# Altium schematic sheet МИЭМ.467999.001Э3(3).SchDoc
size 420 x 297 mm; SheetNumber: 3; SheetTotal: 4; DecimalNumber: МИЭМ.467999.001Э3
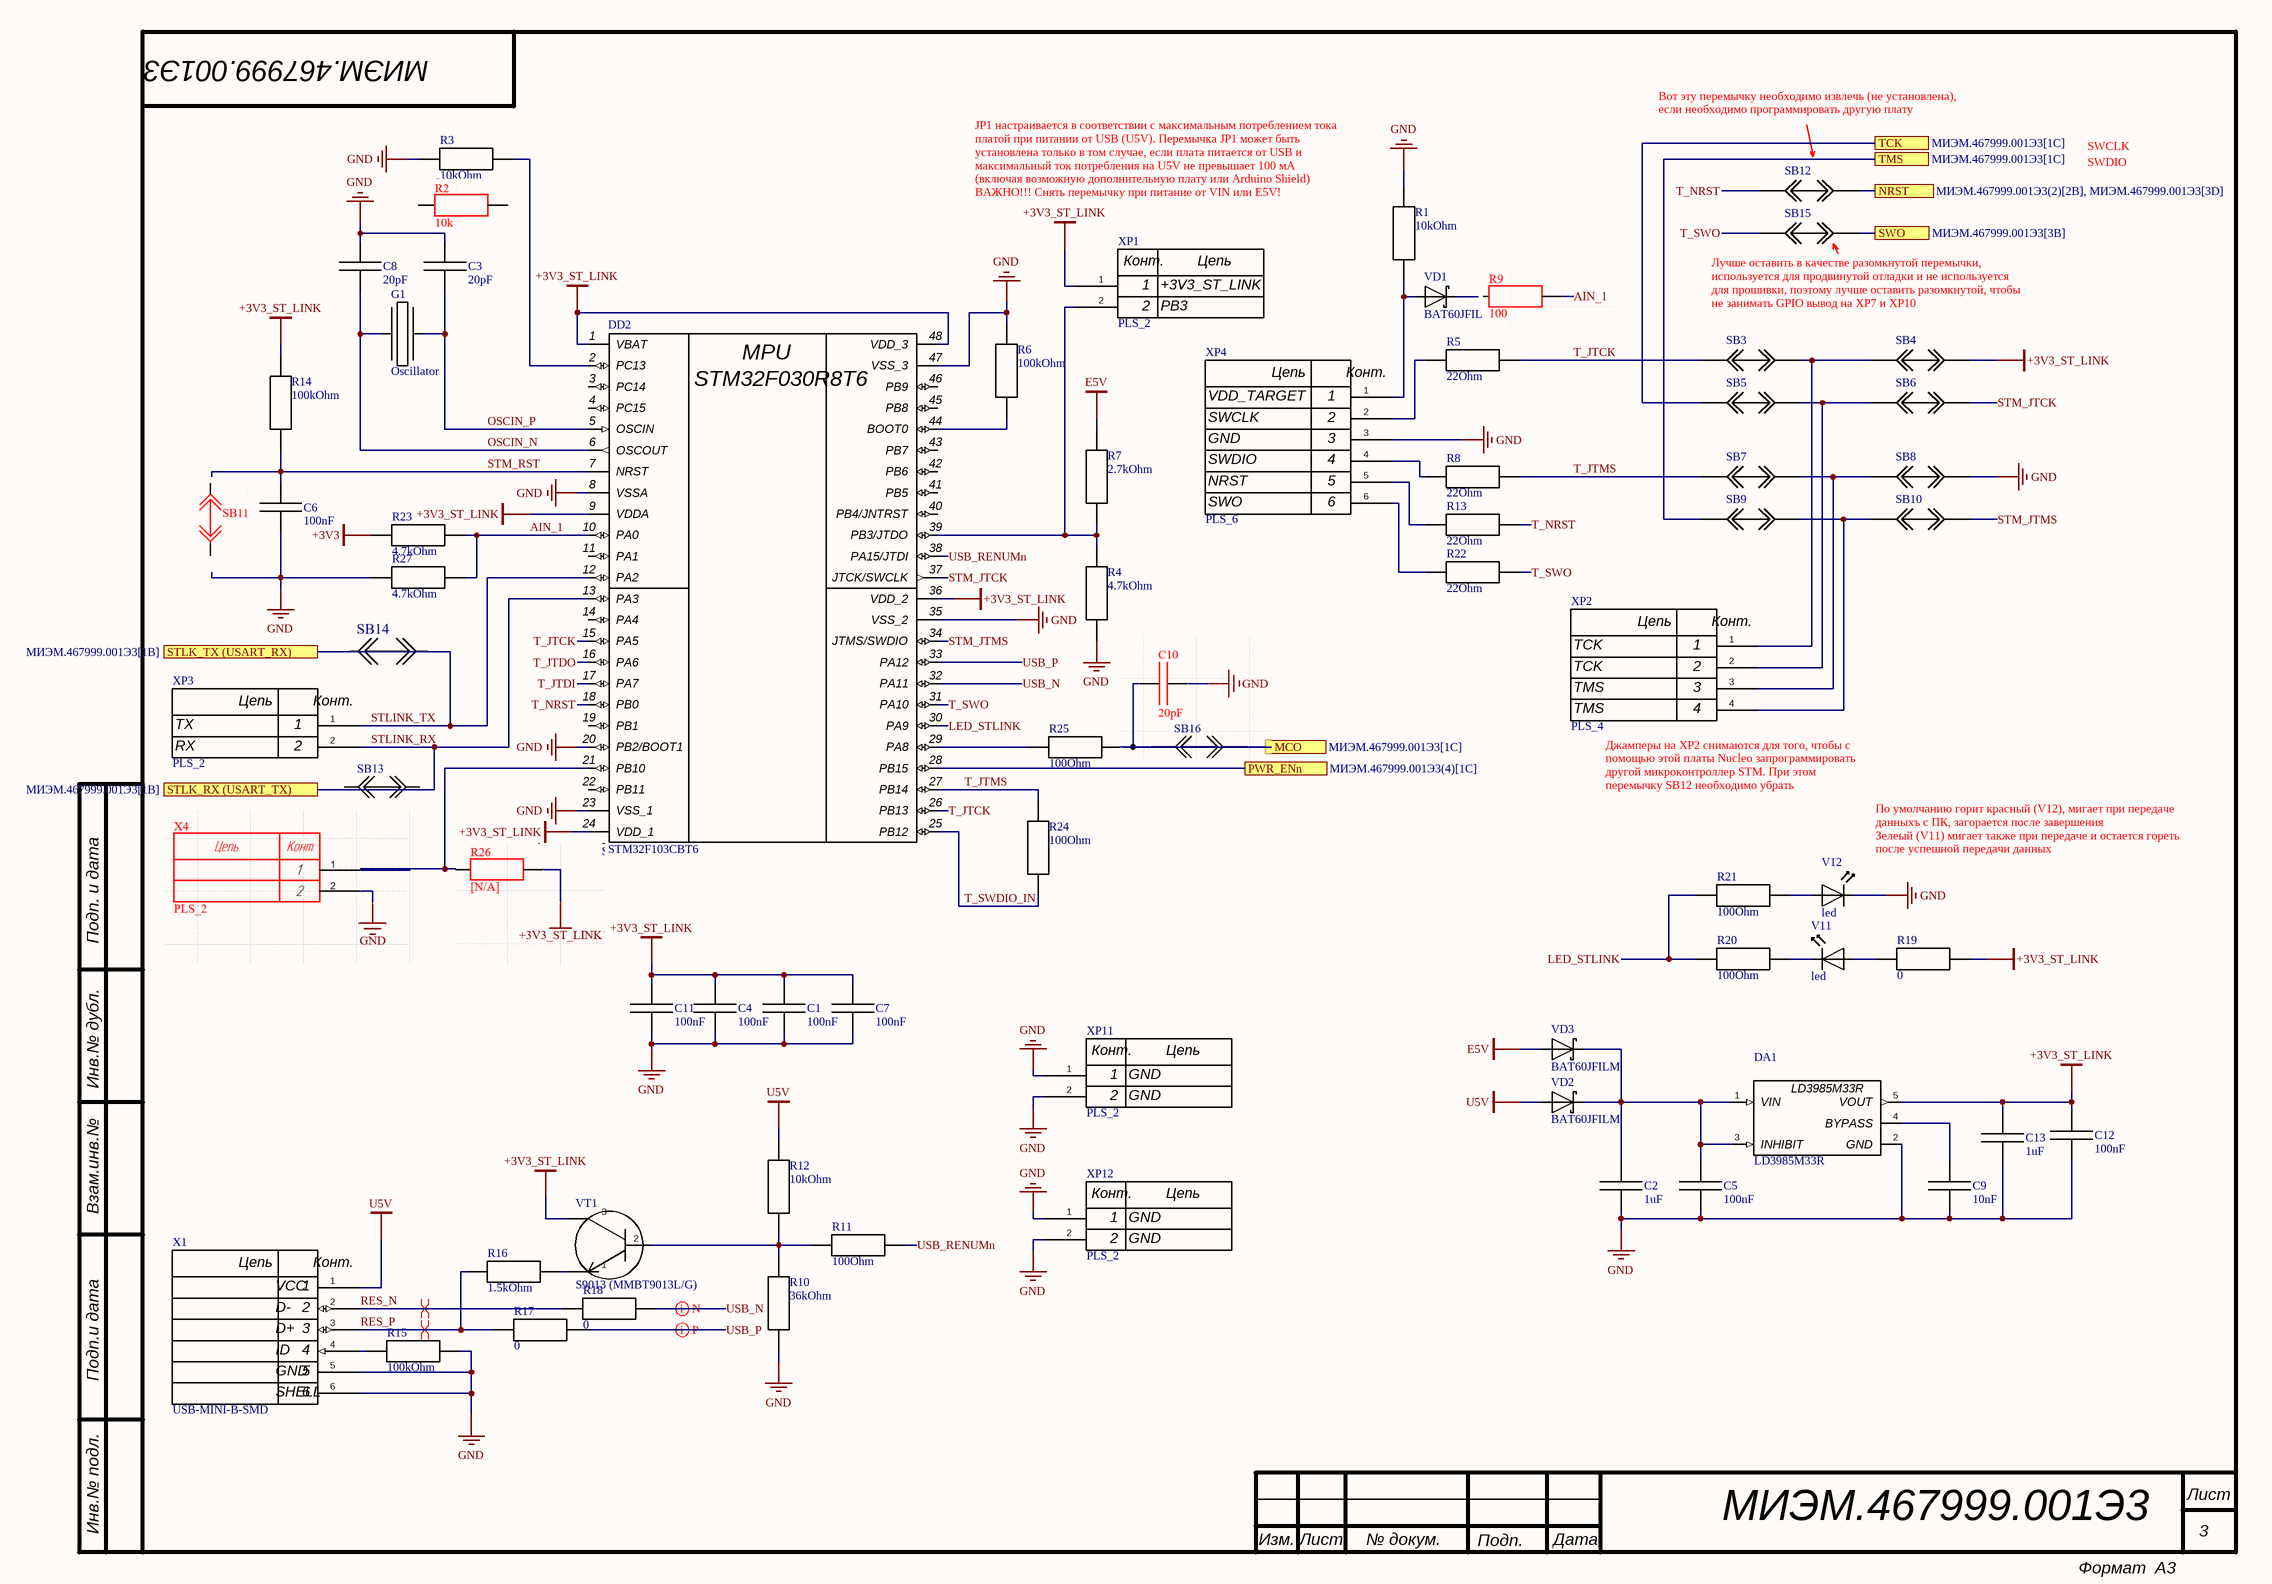
[diagram p0: МИЭМ.467999.001Э3(3).SchDoc]

## Parts
C1  100nF  [0603]
C2  1uF  [0603]
C3  20pF  [0603]
C4  100nF  [0603]
C5  100nF  [0603]
C6  100nF  [0603]
C7  100nF  [0603]
C8  20pF  [0603]
C9  10nF  [0603]
C11  100nF  [0603]
C12  100nF  [0603]
C13  1uF  [0603]
DA1  LD3985M33R  [LD3985M33R (SOT-23-5)]
DD2  STM32F103CBT6  [LQFP48-7x7mm]
G1  Oscillator  [HC49SMD]
R1  10kOhm  [0603]
R3  10kOhm  [0603]
R4  4.7kOhm  [0603]
R5  22Ohm  [0603]
R6  100kOhm  [0603]
R7  2.7kOhm  [0603]
R8  22Ohm  [0603]
R10  36kOhm  [0603]
R11  100Ohm  [0603]
R12  10kOhm  [0603]
R13  22Ohm  [0603]
R14  100kOhm  [0603]
R15  100kOhm  [0603]
R16  1.5kOhm  [0603]
R17  0  [0603]
R18  0  [0603]
R19  0  [0603]
R20  100Ohm  [0603]
R21  100Ohm  [0603]
R22  22Ohm  [0603]
R23  4.7kOhm  [0603]
R24  100Ohm  [0603]
R25  100Ohm  [0603]
R27  4.7kOhm  [0603]
SB3  Jumper  [Jumper]  (value not drawn)
SB4  Jumper  [Jumper]  (value not drawn)
SB5  Jumper  [Jumper]  (value not drawn)
SB6  Jumper  [Jumper]  (value not drawn)
SB7  Jumper  [Jumper]  (value not drawn)
SB8  Jumper  [Jumper]  (value not drawn)
SB9  Jumper  [Jumper]  (value not drawn)
SB10  Jumper  [Jumper]  (value not drawn)
SB12  Jumper  [Jumper]  (value not drawn)
SB15  Jumper  [Jumper]  (value not drawn)
V11  led  [FYLS-0603PGC]
V12  led  [FYLS-0603PGC]
VD1  BAT60JFILM  [BAT60JFILM]
VD2  BAT60JFILM  [BAT60JFILM]
VD3  BAT60JFILM  [BAT60JFILM]
VT1  S9013 (MMBT9013L/G)  [S9013 (SOT_23_3)]
X1  USB-MINI-B-SMD  [USB-MINI-B-SMD]
XP1  PLS_2  [PLS_2]
XP2  PLS_4  [PLS_4]
XP3  PLS_2  [PLS_2]
XP4  PLS_6  [PLS_6]
XP11  PLS_2  [PLS_2]
XP12  PLS_2  [PLS_2]

## Ports
MCO (see МИЭМ.467999.001Э3[1C]), NRST (see МИЭМ.467999.001Э3(2)[2B], МИЭМ.467999.001Э3[3D]), PWR_ENn (see МИЭМ.467999.001Э3(4)[1C]), STLK_RX (USART_TX) (see МИЭМ.467999.001Э3[1B]), STLK_TX (USART_RX) (see МИЭМ.467999.001Э3[1B]), SWO (see МИЭМ.467999.001Э3[3B]), TCK (see МИЭМ.467999.001Э3[1C]), TMS (see МИЭМ.467999.001Э3[1C])

## Nets
+3V3: R23.1
+3V3_ST_LINK: C1.2 C4.2 C7.2 C11.2 C12.2 C13.2 DA1.5(VOUT) DD2.1(VBAT) DD2.9(VDDA) DD2.24(VDD_1) DD2.36(VDD_2) DD2.48(VDD_3) R14.2 R19.2 SB4.2 VT1.3 XP1.1
E5V: R7.2 VD3.2
GND: C1.1 C2.1 C3.2 C4.1 C5.1 C6.1 C7.1 C8.2 C9.1 C11.1 C12.1 C13.1 DA1.2(GND) DD2.8(VSSA) DD2.20(PB2/BOOT1) DD2.23(VSS_1) DD2.35(VSS_2) DD2.47(VSS_3) R1.1 R3.1 R4.1 R6.2 R10.1 R15.2 R27.1 SB8.2 V12.2 X1.5 X1.6 XP4.3 XP11.1 XP11.2 XP12.1 XP12.2
U5V: R12.2 VD2.2 X1.1
AIN_1: DD2.10(PA0) R23.2 R27.2
LED_STLINK: DD2.30(PA9) R20.1 R21.1
MCO: R25.1 ; port MCO
NRST: SB12.2 ; port NRST
OSCIN_N: C8.1 DD2.6(OSCOUT) G1.1
OSCIN_P: C3.1 DD2.5(OSCIN) G1.2
PWR_ENn: DD2.28(PB15) ; port PWR_ENn
RES_N: R18.1 X1.2
RES_P: R16.1 R17.1 X1.3
STLINK_RX: DD2.13(PA3) XP3.2 ; port STLK_RX (USART_TX)
STLINK_TX: DD2.12(PA2) XP3.1 ; port STLK_TX (USART_RX)
STM_JTCK: DD2.37(JTCK/SWCLK) SB6.2
STM_JTMS: DD2.34(JTMS/SWDIO) SB10.2
STM_RST: C6.2 DD2.7(NRST) R14.1
SWO: SB15.2 ; port SWO
T_JTCK: DD2.15(PA5) DD2.26(PB13) R5.1 SB3.1
T_JTDI: DD2.17(PA7)
T_JTDO: DD2.16(PA6)
T_JTMS: DD2.27(PB14) R8.1 R24.2 SB7.1
T_NRST: DD2.18(PB0) R13.1 SB12.1
T_SWDIO_IN: DD2.25(PB12) R24.1
T_SWO: DD2.31(PA10) R22.1 SB15.1
TCK: SB5.1 ; port TCK
TMS: SB9.1 ; port TMS
USB_N: DD2.32(PA11) R18.2
USB_P: DD2.33(PA12) R17.2
USB_RENUMn: DD2.38(PA15/JTDI) R11.1
NetC2_2: C2.2 C5.2 DA1.1(VIN) DA1.3(INHIBIT) VD2.1 VD3.1
NetC9_2: C9.2 DA1.4(BYPASS)
NetDD2_2: DD2.2(PC13) R3.2
NetDD2_29: DD2.29(PA8) R25.2
NetDD2_39: DD2.39(PB3/JTDO) R4.2 R7.1 XP1.2
NetDD2_44: DD2.44(BOOT0) R6.1
NetR1_2: R1.2 VD1.2 XP4.1
NetR5_2: R5.2 XP4.2
NetR8_2: R8.2 XP4.4
NetR10_2: R10.2 R11.2 R12.1 VT1.2
NetR13_2: R13.2 XP4.5
NetR15_1: R15.1 X1.4
NetR16_2: R16.2 VT1.1
NetR19_1: R19.1 V11.1
NetR20_2: R20.2 V11.2
NetR21_2: R21.2 V12.1
NetR22_2: R22.2 XP4.6
NetSB3_2: SB3.2 SB4.1 XP2.1
NetSB5_2: SB5.2 SB6.1 XP2.2
NetSB7_2: SB7.2 SB8.1 XP2.3
NetSB9_2: SB9.2 SB10.1 XP2.4

Not connected (* = marked no-connect by the designer): DD2 3(PC14) 4(PC15) 11(PA1) 14(PA4) 19(PB1) 21(PB10) 22(PB11) 40(PB4/JNTRST) 41(PB5) 42(PB6) 43(PB7) 45(PB8) 46(PB9); VD1 1

## Layout directives
differential pair: RES_N, RES_P, USB_N, USB_P

## Notes on the sheet
- Вот эту перемычку необходимо извлечь (не установлена), если необходимо программировать другую плату
- SWCLK
- SWDIO
- JP1 настраивается в соответствии с максимальным потреблением тока платой при питании от USB (U5V). Перемычка JP1 может быть установлена только в том случае, если плата питается от USB и максимальный ток потребления на U5V не превышает 100 мА (включая возможную дополнительную плату или Arduino Shield)
  ВАЖНО!!! Снять перемычку при питание от VIN или E5V!
- (near XP1) 1
- (near XP1) 2
- (near XP1) +3V3_ST_LINK
- (near XP1) PB3
- (near SB15) Лучше оставить в качестве разомкнутой перемычки, используется для продвинутой отладки и не используется для прошивки, поэтому лучше оставить разомкнутой, чтобы не занимать GPIO вывод на XP7 и XP10
- VDD_TARGET
- GND
- (near XP4) 1
- (near XP4) 2
- (near XP4) 3
- NRST
- SWO
- (near XP4) 4
- (near XP4) 5
- (near XP4) 6
- TCK
- (near XP2) 1
- TX
- (near XP3) 1
- TMS
- (near XP2) 2
- (near XP2) 3
- (near XP2) 4
- RX
- (near XP3) 2
- (near XP2) Джамперы на XP2 снимаются для того, чтобы с помощью этой платы Nucleo запрограммировать другой микроконтроллер STM. При этом перемычку SB12 необходимо убрать
- (near V12) По умолчанию горит красный (V12), мигает при передаче данныхъ с ПК, загорается после завершения
  Зелеый (V11) мигает также при передаче и остается гореть после успешной передачи данных
- (near XP11) 1
- (near XP11) 2
- (near XP11) GND
- (near XP12) 1
- (near XP12) 2
- (near XP12) GND
- Подп. и дата
- Инв.№ дубл.
- Взам.инв.№
- Подп.и дата
- Инв.№ подл.
- Изм.
- Лист
- № докум.
- Подп.
- Дата
- Формат  A3
- (in symbol PLS_2) Цепь; Конт.
- (in symbol PLS_4) Цепь; Конт.
- (in symbol PLS_6) Цепь; Конт.
- (in symbol STM32F103CBT6) MPU; STM32F030R8T6
- (in symbol USB-MINI-B-SMD) Цепь; Конт.; VCC; D-; D+; ID; GND; SHELL

## Library data of the parts
C1 C4-C7 C11 C12 = Сapacitor: PartNumber: CC0603KRX7R0BB104; Manufacturer: Yageo; VCC: 100В; Tolerance: 10%; Ta: 125°C; Value: 100nF; Package: 0603; ComponentLink1Description: Datasheet; ComponentLink1URL: *; ComponentLink2Description: Source
  C1 C5 C6 C11 C12: ComponentLink2URL: https://www.chipdip.ru/product/0.1mkf-x7r-100v-10-0603-cc0603krx7r0bb104-kondensator-yageo-9000578715
  C4 C7: ComponentLink2URL: *
C2 C13 = Сapacitor: PartNumber: GRM185R61A105K; Manufacturer: Murata Electronics; VCC: 10В; Tolerance: 10%; Ta: 85°C; Value: 1uF; Package: 0603; ComponentLink1Description: Datasheet; ComponentLink1URL: *; ComponentLink2Description: Source; ComponentLink2URL: https://www.chipdip.ru/product/1mkf-x5r-10v-10-0603-grm185r61a105k-kondensator-murata-767906735
C3 C8 = Сapacitor: PartNumber: GRM1885C1H200J; Manufacturer: Murata Electronics; VCC: 50В; Tolerance: 5%; Ta: 125°C; Value: 20pF; Package: 0603; ComponentLink1Description: Datasheet; ComponentLink1URL: *; ComponentLink2Description: Source; ComponentLink2URL: https://www.chipdip.ru/product/20pf-np0-50v-5-0603-grm1885c1h200j-kondensator-murata-268501846
C9 = Сapacitor: PartNumber: CC0603KRX7R0BB103; Manufacturer: Yageo; VCC: 100В; Tolerance: 10%; Ta: 125°C; Value: 10nF; Package: 0603; ComponentLink1Description: Datasheet; ComponentLink1URL: *; ComponentLink2Description: Source; ComponentLink2URL: https://www.chipdip.ru/product/0.01mkf-x7r-100v-10-0603-cc0603krx7r0bb103-yageo-9000501772
DA1 = LD3985M33R: Manufacturer: STMicroelectronics; Desc: Стабилизатор напряжения линейный; VCC: 6 В; Vout: 3.3 В; Ta: 125 °C; ComponentLink1Description: Source; ComponentLink1URL: https://www.chipdip.ru/product/ld3985m33r-regulyator-s-nizkim-padeniem-st-microelectronics-9060001543; ComponentLink2Description: Datasheet; ComponentLink2URL: *; Package: SOT-23-5
DD2 = STM32F103CBT6: Manufacturer: STMicroelectronics; Desc: Микроконтроллер 32-Бит; Frequency: 72МГц; Ta: 85°C; ComponentLink1Description: Source; ComponentLink1URL: https://www.chipdip.ru/product/stm32f103cbt6-mikrokontroller-32-bit-st-microelectronics-9000052539; ComponentLink2Description: Datasheet; ComponentLink2URL: https://static.chipdip.ru/lib/597/DOC018597489.pdf; Package: LQFP-48; PartNumber: STM32F103CBT6; ClassName: STM
G1 = Oscillator: Desc: Осциллятор кварцевый; Frequence: 8МГц; Ta: 70°С; ComponentLink1Description: Source; ComponentLink1URL: https://www.chipdip.ru/product/hc49smd-8-mhz-20pf-30ppm-kvartsevyy-rezonator-ruichi-8007334696; ComponentLink2Description: Datasheet; ComponentLink2URL: *; Tolerance: *
R1 R3 R12 = Resistor: PartNumber: RC0603FR-0710KL; VCC: 50В; Power: 0.1Вт; Ta: 155°C; Tolerance: 1%; Value: 10kOhm; Package: 0603; Manufacturer: *; ComponentLink1Description: Datasheet; ComponentLink1URL: *; ComponentLink2Description: Source; ComponentLink2URL: https://www.chipdip.ru/product/0.1vt-0603-10-kom-1-chip-rezistor-smd-9000079736
R4 R23 R27 = Resistor: PartNumber: RC0603JR-074K7L; Manufacturer: Yageo; VCC: 75В; Power: 0.1Вт; Ta: 155°C; Tolerance: 5%; Value: 4.7kOhm; Package: 0603; ComponentLink1Description: Datasheet; ComponentLink1URL: *; ComponentLink2Description: Source; ComponentLink2URL: https://www.chipdip.ru/product/0.1vt-0603-4.7-kom-5-rc0603jr-074k7l-chip-rezistor-yageo-9000301240
R5 R8 R13 R22 = Resistor: PartNumber: RC0603FR-0722RL; VCC: 50В; Power: 0.1Вт; Ta: 155°C; Tolerance: 1%; Value: 22Ohm; Package: 0603; Manufacturer: *; ComponentLink1Description: Datasheet; ComponentLink1URL: *; ComponentLink2Description: Source; ComponentLink2URL: https://www.chipdip.ru/product/0.1vt-0603-22-om-1-chip-rezistor-smd-9000079564
R6 R14 R15 = Resistor: PartNumber: 0603WAF1003T5E; Manufacturer: UNI-ROYAL(Uniroyal Elec); VCC: 75В; Power: 0.1Вт; Ta: 155°C; Tolerance: 1%; Value: 100kOhm; Package: 0603; ComponentLink1Description: Datasheet; ComponentLink1URL: *; ComponentLink2Description: Source; ComponentLink2URL: https://www.chipdip.ru/product/0603waf1003t5e-rezistor-tolstoplenochnyy-100mvt-uni-royal-8033183962
R7 = Resistor: PartNumber: RC0603JR-072K7L; Manufacturer: Yageo; VCC: 75В; Power: 0.1Вт; Ta: 155°C; Tolerance: 5%; Value: 2.7kOhm; Package: 0603; ComponentLink1Description: Datasheet; ComponentLink1URL: *; ComponentLink2Description: Source; ComponentLink2URL: https://www.chipdip.ru/product/0.1vt-0603-2.7-kom-5-rc0603jr-072k7l-chip-rezistor-yageo-9000381530
R10 = Resistor: PartNumber: RC0603JR-0736KL; Manufacturer: Yageo; VCC: 75В; Power: 0.1Вт; Ta: 155°C; Tolerance: 5%; Value: 36kOhm; Package: 0603; ComponentLink1Description: Datasheet; ComponentLink1URL: *; ComponentLink2Description: Source; ComponentLink2URL: https://www.chipdip.ru/product/0.1vt-0603-36-kom-5-rc0603jr-0736kl-chip-rezistor-smd-yageo-9001745834
R11 R20 R21 R24 R25 = Resistor: PartNumber: AC0603FR-07100RL; Manufacturer: Yageo; VCC: 75В; Power: 0.1Вт; Ta: 155°C; Tolerance: 1%; Value: 100Ohm; Package: 0603; ComponentLink1Description: Datasheet; ComponentLink1URL: *; ComponentLink2Description: Source; ComponentLink2URL: https://www.chipdip.ru/product/0.1vt-0603-100-om-1-ac0603fr-07100rl-chip-rezistor-yageo-9000495858
R16 = Resistor: PartNumber: RC0603FR-071K5L; VCC: 50В; Power: 0.1Вт; Ta: 155°C; Tolerance: 1%; Value: 1.5kOhm; Package: 0603; Manufacturer: *; ComponentLink1Description: Datasheet; ComponentLink1URL: *; ComponentLink2Description: Source; ComponentLink2URL: https://www.chipdip.ru/product/0.1vt-0603-1.5-kom-1-chip-rezistor-smd-9000079716
R17-R19 = Resistor: PartNumber: RC0603FR-070RL; Manufacturer: Yageo; VCC: 75В; Power: 0.1Вт; Ta: 155°C; Tolerance: 1%; Value: 0; Package: 0603; ComponentLink1Description: Datasheet; ComponentLink1URL: *; ComponentLink2Description: Source; ComponentLink2URL: https://www.chipdip.ru/product/0.1vt-0603-0-om-1-rc0603fr-070rl-chip-rezistor-smd-yageo-9001227234
SB3 SB5 SB7 SB9 SB12 SB15 = Jumper: Desc: Перемычка; State: Установлен
SB4 SB6 SB8 SB10 = Jumper: Desc: Перемычка; State: Не установлен
V11 V12 = led: Manufacturer: Ningbo Foryard Optoelectronics; Desc: Диод светоизлучающий; PartNumber: FYLS-0603PGC; Package: 0603; Color: Зеленый; ComponentLink1Description: Source; Ta: *
  V11: ComponentLink1URL: *
  V12: ComponentLink1URL: https://www.chipdip.ru/product/fyls-0603pgc-svetodiod-smd-1-6x0-8mm-zelenyy-525nm-foryard-9000204615
VD1-VD3 = BAT60JFILM: Manufacturer: STMicroelectronics; VCC: 10В; Desc: Диод Шоттки; Ta: 125°C; ComponentLink1Description: Source; ComponentLink1URL: https://www.chipdip.ru/product/bat60jfilm-diod-shottki-3a-10v-sod-323-st-microelectronics-9000198985; Package: SOD-323; ComponentLink2Description: Datasheet; ComponentLink2URL: *
VT1 = S9013 (MMBT9013L/G): Manufacturer: Hottech; VCC: 40В; Power: 0.3Вт; Ta: 150°C; Type: NPN; ComponentLink1Description: Source; ComponentLink1URL: https://www.chipdip.ru/product/s9013-tranzistor-npn-25v-0.5a-hfe-120-400-0.3vt-hottech-9001276075; ComponentLink2Description: Datasheet; ComponentLink2URL: *; Package: SOT-23-3; PartNumber: S9013
X1 = USB-MINI-B-SMD: PartNumber: 1734035-1; Desc: Разъем mini-USB на плату SMD; ComponentLink1Description: Source; ComponentLink1URL: https://www.chipdip.ru/product/1734035-1-razem-mini-usb-na-platu-smd-te-connectivity-9000149111
XP1 XP3 XP11 XP12 = PLS_2: Desc: Соединение контактное; PartNumber: PLS_2
XP2 = PLS_4: Desc: Соединение контактное; PartNumber: PLS_4
XP4 = PLS_6: Desc: Соединение контактное; PartNumber: PLS_6